# Altium project Power_backup_supercap.PrjPcb
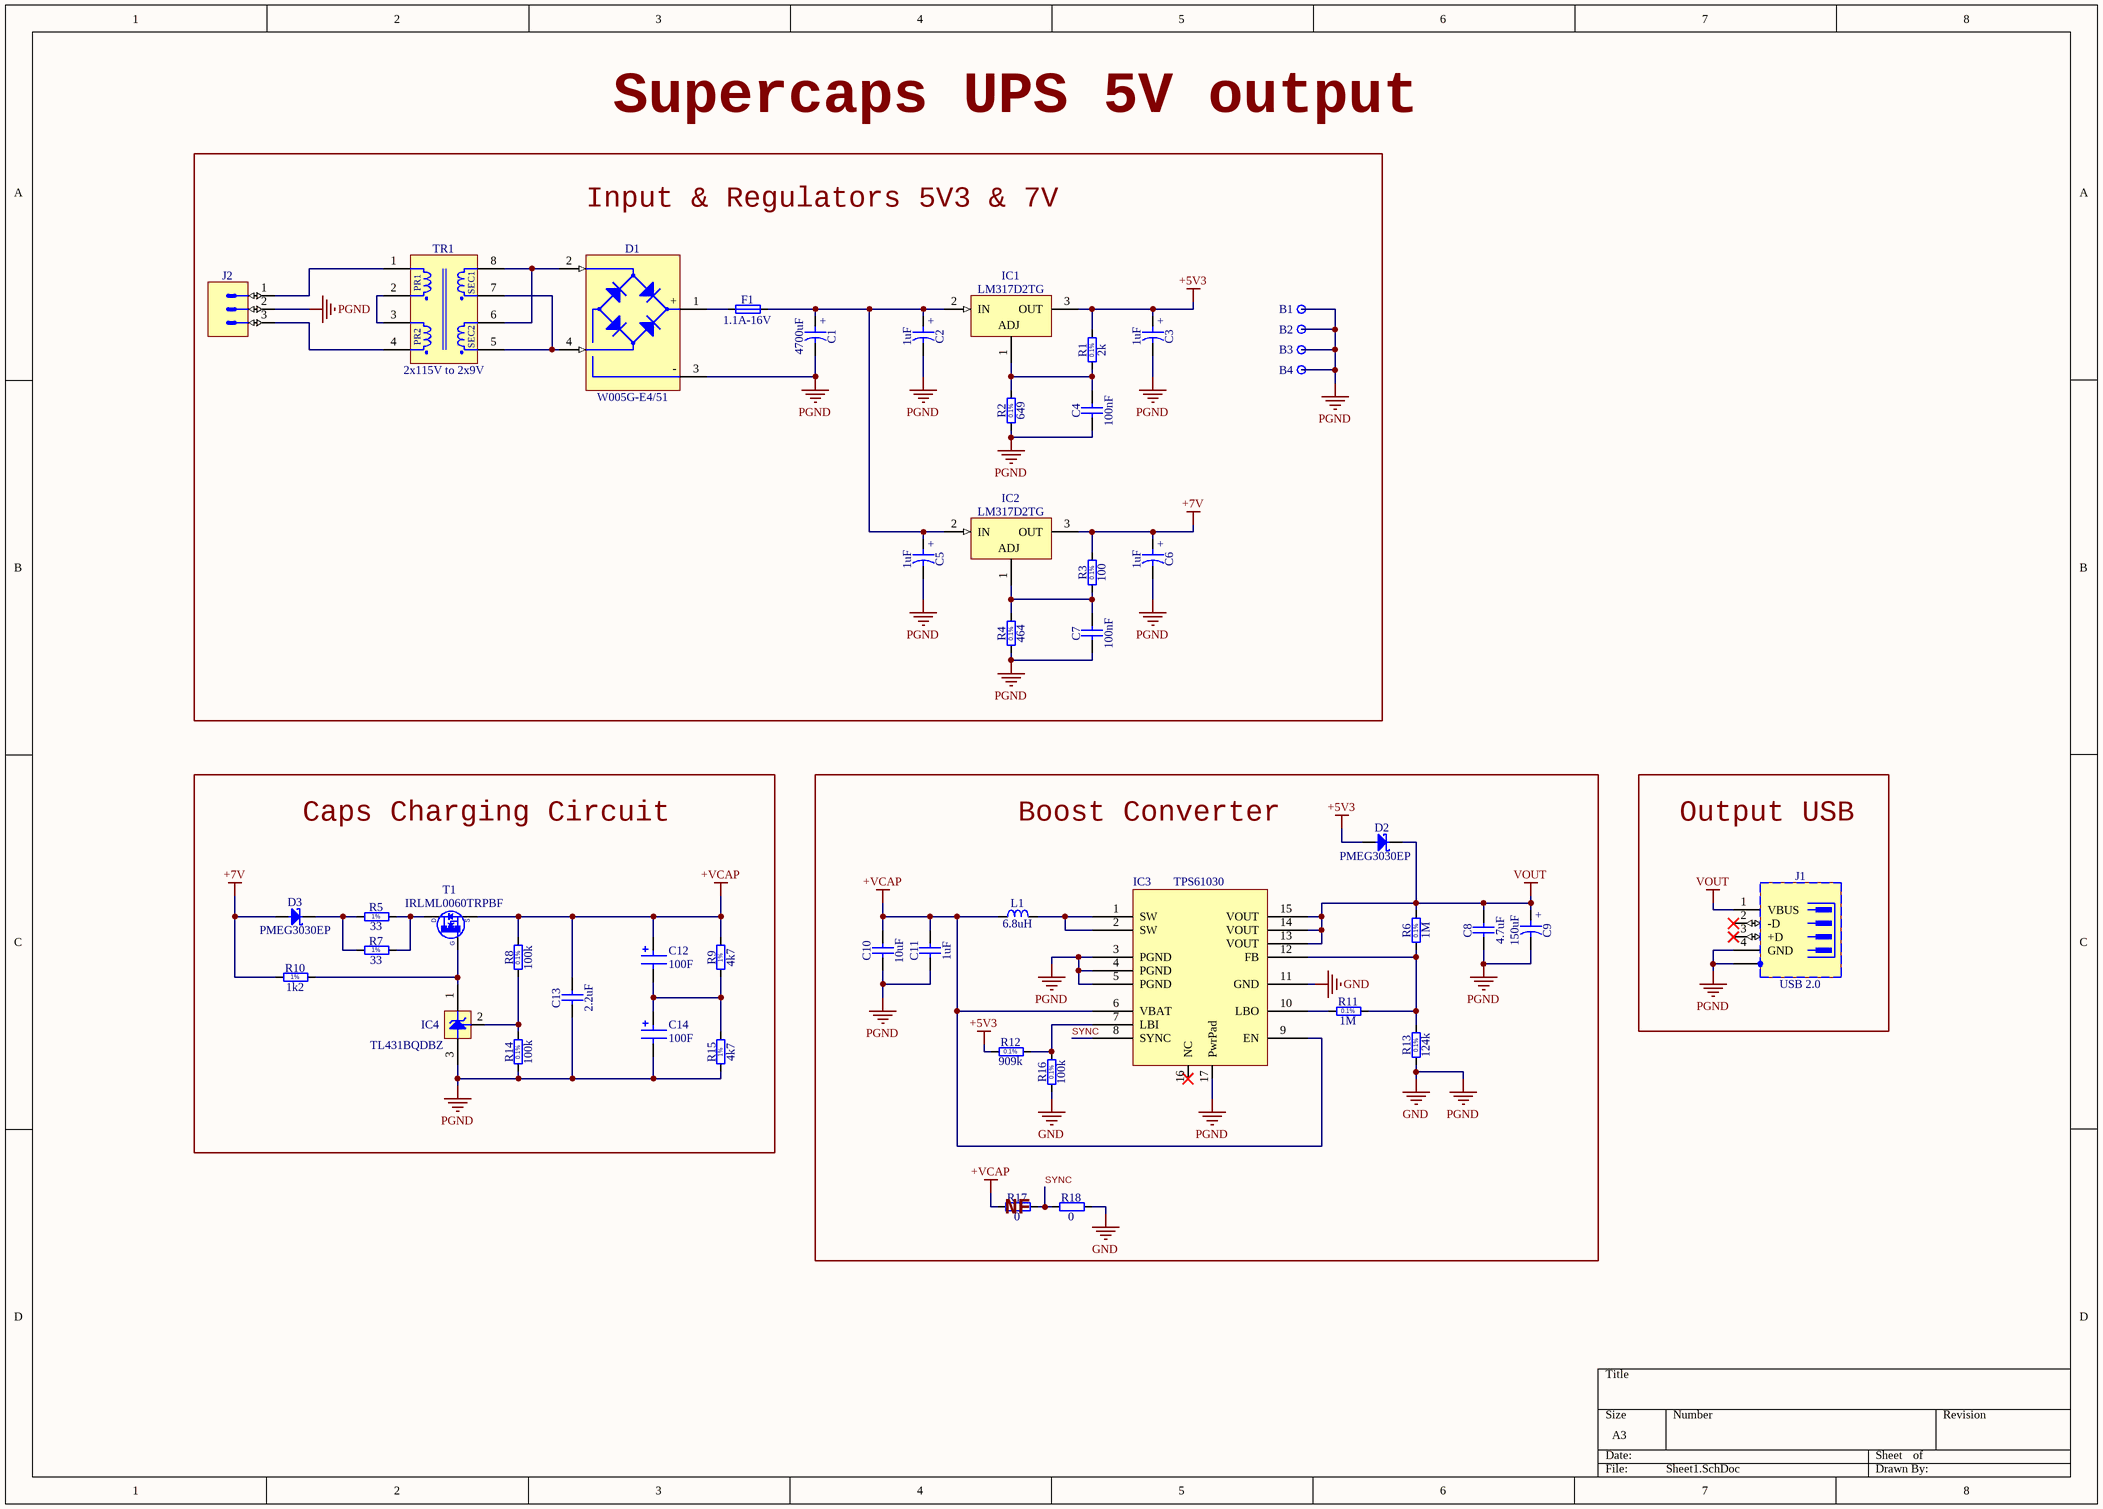
[diagram p0: Sheet1.SchDoc]
1 sheet, 49 parts. Net scope: global (net labels, ports and power ports of the same name join across sheets).
Board file: Backup_Supercap.PcbDoc

## Sheet Sheet1.SchDoc
size A3

### Parts
B1  Plated Hole  [MTG240_400]  (value not drawn)
B2  Plated Hole  [MTG240_400]  (value not drawn)
B3  Plated Hole  [MTG240_400]  (value not drawn)
B4  Plated Hole  [MTG240_400]  (value not drawn)
C1  4700uF  [CAPAE1900X1680N]
C2  1uF  [CAPMP3528X210N]
C3  1uF  [CAPMP3528X210N]
C4  100nF  [CAPC2012X88N]
C5  1uF  [CAPMP3528X210N]
C6  1uF  [CAPMP3528X210N]
C7  100nF  [CAPC2012X88N]
C8  4.7uF  [CAPC2012X135N]
C9  150uF  [CAPMP6032X280N]
C10  10uF  [CAPC2012X135N]
C11  1uF  [CAPC2012X135N]
C12  100F  [CAPPR750-1850X4650]
C13  2.2uF  [CAPC2012X140N]
C14  100F  [CAPPR750-1850X4650]
D1  W005G-E4/51  [VISHAY_WOG]
D2  PMEG3030EP  [SODFL4725X110N]
D3  PMEG3030EP  [SODFL4725X110N]
F1  1.1A-16V  [FUSR_BOURNS_MF-MSMF_STYLE1(H85)]
IC1  LM317D2TG  [TO254P1420X457-3N-R795X1023]
IC2  LM317D2TG  [TO254P1420X457-3N-R795X1023]
IC3  TPS61030  [SOP65P640X110-17N-S274]
IC4  TL431BQDBZ  [SOT95P250X110-3N]
J1  USB 2.0  [WURTH_614 104 150 121]
J2  MATE-N-LOK  [TYCO_1-770170-1]  (value not drawn)
L1  6.8uH  [IND_BOURNS_SRU8043]
R1  2k  [RESC2012X60N]
R2  649  [RESC2012X60N]
R3  100  [RESC2012X60N]
R4  464  [RESC2012X60N]
R5  33  [RESC6331X70N]
R6  1M  [RESC2012X60N]
R7  33  [RESC6331X70N]
R8  100k  [RESC2012X60N]
R9  4k7  [RESC2012X60N]
R10  1k2  [RESC2012X60N]
R11  1M  [RESC2012X60N]
R12  909k  [RESC2012X60N]
R13  124k  [RESC2012X60N]
R14  100k  [RESC2012X60N]
R15  4k7  [RESC2012X60N]
R16  100k  [RESC2012X60N]
R17  0  [RESC2012X60N]
R18  0  [RESC2012X60N]
T1  IRLML0060TRPBF  [SOT95P237X112-3N]
TR1  2x115V to 2x9V  [XFMR_BLOCK_FL6]

### Blocks framed on the sheet
Input & Regulators 5V3 & 7V: B1-B4 C1-C7 D1 F1 IC1 IC2 J2 R1-R4 TR1
Caps Charging Circuit: C12-C14 D3 IC4 R5 R7-R10 R14 R15 T1
Boost Converter: C8-C11 D2 IC3 L1 R6 R11-R13 R16-R18
Output USB: J1

### Nets
+5V3: C3.1 D2.2(A) IC1.3(OUT) R1.2 R12.1
+7V: C6.1 D3.2(A) IC2.3(OUT) R3.2 R10.1
+VCAP: C10.2 C11.2 C12.1 C13.2 IC3.6(VBAT) IC3.9(EN) L1.1 R8.2 R9.2 R17.1 T1.2(S)
GND: B1.1 B2.1 B3.1 B4.1 C1.2 C2.2 C3.2 C4.1 C5.2 C6.2 C7.1 C8.1 C9.2 C10.1 C11.1 C13.1 C14.2 D1.3(-) IC3.3(PGND) IC3.4(PGND) IC3.5(PGND) IC3.11(GND) IC3.17(PwrPad) IC4.3(A) J1.4(GND) J1.5(SHIELD) J2.2 R2.1 R4.1 R13.1 R14.1 R15.1 R16.1 R18.2  [also labelled PGND]
VOUT: C8.2 C9.1 D2.1(C) IC3.13(VOUT) IC3.14(VOUT) IC3.15(VOUT) J1.1(VBUS) R6.2
SYNC: IC3.8(SYNC) R17.2 R18.1
NetC1_1: C1.1 C2.1 C5.1 F1.2 IC1.2(IN) IC2.2(IN)
NetC4_2: C4.2 IC1.1(ADJ) R1.1 R2.2
NetC7_2: C7.2 IC2.1(ADJ) R3.1 R4.2
NetC12_2: C12.2 C14.1 R9.1 R15.2
NetD1_1: D1.1(+) F1.1
NetD1_2: D1.2(AC) TR1.6(S2) TR1.8(S1)
NetD1_4: D1.4(AC) TR1.5(S2) TR1.7(S1)
NetD3_1: D3.1(C) R5.1 R7.1
NetIC3_1: IC3.1(SW) IC3.2(SW) L1.2
NetIC3_7: IC3.7(LBI) R12.2 R16.2
NetIC3_10: IC3.10(LBO) R11.1
NetIC3_12: IC3.12(FB) R6.1 R11.2 R13.2
NetIC4_1: IC4.1(C) R10.2 T1.1(G)
NetIC4_2: IC4.2(Adj) R8.1 R14.2
NetJ2_1: J2.1 TR1.1(P1)
NetJ2_3: J2.3 TR1.4(P2)
NetR5_2: R5.2 R7.2 T1.3(D)
NetTR1_2: TR1.2(P1) TR1.3(P2)

Not connected (* = marked no-connect by the designer): IC3 16(NC)*; J1 2(-D)* 3(+D)*

### Notes on the sheet
- Supercaps UPS 5V output
- (near R17) NF
- (in symbol CAE1900-1680_4700UF_16V_20%) +
- (in symbol CTE3528-21_1UF_35V_10%_LESR2000) +
- (in symbol CTE6032-28_150UF_10V_10%) +
- (in symbol R0805_1K2_1%_0.125W_100PPM) 1%
- (in symbol R0805_1M_0.1%_0.1W_25PPM) 0.1%
- (in symbol R0805_2K_0.1%_0.1W_10PPM) 0.1%
- (in symbol R0805_4K7_1%_0.125W_100PPM) 1%
- (in symbol R0805_100K_0.1%_0.1W_10PPM) 0.1%
- (in symbol R0805_100R_0.1%_0.1W_10PPM) 0.1%
- (in symbol R0805_124K_0.1%_0.1W_10PPM) 0.1%
- (in symbol R0805_464R_0.1%_0.1W_10PPM) 0.1%
- (in symbol R0805_649R_0.1%_0.1W_10PPM) 0.1%
- (in symbol R0805_909K_0.1%_0.1W_10PPM) 0.1%
- (in symbol R2512_33R_1%_1W_100PPM) 1%
- (in symbol XFMR_BLOCK_FL6/6) PR1; SEC1; PR2; SEC2

### Library data of the parts
B1-B4 = PLATED_HOLE2.4_PAD4.0: Single Terminal Socket; Part Description: Plated Through Hole: Hole Dia.=2.4mm Pad Dia.=4.0mm; Mounted: No; Part Number: PLATED_HOLE2.4_PAD4.0; Component Kind: Standard (No BOM); Component Type: Standard (No BOM); Pin Count: 1; Family: Plated Hole; Socket: No; SMD: No; Sense: No; Status: None; ComponentHeight: 0mm; HelpURL: Undefined; Author: CERN DEM JMW; CreateDate: 10/10/2011; LatestRevisionDate: 10/10/2011; PackageDescription: Plated Through Hole: Hole Dia.=2.4mm Pad Dia.=4.0mm
C1 = CAE1900-1680_4700UF_16V_20%: Polarised capacitor; Part Description: Aluminum Electrolytic SMT Capacitor; Manufacturer: PANASONIC; Manufacturer Part Number: EEVFK1C472M; Voltage: 16V; Tolerance: ±20%; Part Number: CAE1900-1680_4700UF_16V_20%; Component Kind: Standard; Component Type: Standard; Pin Count: 2; Value: 4700uF; Status: Not Recommended; Case: K16; Mounted: Yes; Socket: No; SMD: Yes; Sense: No; ComponentHeight: 16.8mm; HelpURL: \\cern.ch\dfs\Applications\Altium\Datasheets\CAE_PANASONIC_FK.pdf; Author: CERN DEM JLC; CreateDate: 05/11/2014; LatestRevisionDate: 05/11/2014
C2 C3 C5 C6 = CTE3528-21_1UF_35V_10%_LESR2000: Polarised capacitor; Part Description: Low ESR 2R Solid Tantalum Chip Capacitor; Manufacturer: GENERIC; Manufacturer1 Part Number: TPSB105K035R2000; Voltage: 35V; Tolerance: ±10%; Part Number: CTE3528-21_1UF_35V_10%_LESR2000; Component Kind: Standard; Component Type: Standard; Pin Count: 2; Value: 1uF; Status: Preferred; Manufacturer Part Number: CTE3528-21_1UF_35V_10%_LESR2000; Case: B; Mounted: Yes; Socket: No; SMD: Yes; Sense: No; Manufacturer1 Example: AVX; Manufacturer1 ComponentHeight: 2.1mm; HelpURL: \\cern.ch\dfs\Applications\Altium\Datasheets\CTE-LESR_AVX_TPS.pdf; Author: CERN DEM MR; CreateDate: 04/10/2016; LatestRevisionDate: 04/10/2016
C4 C7 = CC0805_100NF_50V_10%_X7R_YUDEN_UMK212B7104KGHT: Non-polarised capacitor; Part Description: SMD Multilayer Chip Ceramic Capacitor (High Dielectric Type) for Automotive / Industrial Applications; Manufacturer: TAIYO YUDEN; Voltage: 50V; TC: X7R; Tolerance: ±10%; Part Number: CC0805_100NF_50V_10%_X7R_YUDEN_UMK212B7104KGHT; Component Kind: Standard; Component Type: Standard; Pin Count: 2; Value: 100nF; Status: Not Recommended; Manufacturer Part Number: UMK212B7104KGHT; Case: 0805; Mounted: Yes; Socket: No; SMD: Yes; Sense: No; ComponentHeight: 1.35mm; HelpURL: \\cern.ch\dfs\Applications\Altium\Datasheets\CC0805_TAIYO-YUDEN_UMK212B7104KGHT.pdf; Author: CERN DEM JLC; CreateDate: 23/04/2015; LatestRevisionDate: 23/04/2015
C8 = CC0805_4.7UF_10V_10%_X5R: Non-polarised capacitor; Part Description: SMD Multilayer Chip Ceramic Capacitor; Manufacturer: GENERIC; Manufacturer1 Part Number: 222224013672; Voltage: 10V; TC: X5R; Tolerance: ±10%; Part Number: CC0805_4.7UF_10V_10%_X5R; Component Kind: Standard; Component Type: Standard; Pin Count: 2; Value: 4.7uF; Status: Preferred; Manufacturer Part Number: CC0805_4.7UF_10V_10%_X5R; Case: 0805; Mounted: Yes; Socket: No; SMD: Yes; Sense: No; Manufacturer1 Example: PHYCOMP; Manufacturer1 ComponentHeight: 1.45mm; HelpURL: \\cern.ch\dfs\Applications\Altium\Datasheets\CC0805_X5R_PHYCOMP_HC.pdf; Author: CERN DEM JLC; CreateDate: 03/12/2007; LatestRevisionDate: 03/12/2007
C9 = CTE6032-28_150UF_10V_10%: Polarised capacitor; Part Description: Solid Tantalum Chip Capacitor; Manufacturer: GENERIC; Manufacturer1 Part Number: TAJC157K010R; Voltage: 10V; Tolerance: ±10%; Part Number: CTE6032-28_150UF_10V_10%; Component Kind: Standard; Component Type: Standard; Pin Count: 2; Value: 150uF; Status: Preferred; Manufacturer Part Number: CTE6032-28_150UF_10V_10%; Case: C; Mounted: Yes; Socket: No; SMD: Yes; Sense: No; Manufacturer1 Example: AVX; Manufacturer1 ComponentHeight: 2.8mm; HelpURL: \\cern.ch\dfs\Applications\Altium\Datasheets\CTE_AVX_TAJ.pdf; Author: CERN DEM JLC; CreateDate: 03/12/2007; LatestRevisionDate: 03/12/2007
C10 = CC0805_10UF_16V_10%_X5R: Non-polarised capacitor; Part Description: SMD Multilayer Chip Ceramic Capacitor; Manufacturer: GENERIC; Manufacturer1 Part Number: C0805C106K4PAC; Voltage: 16V; TC: X5R; Tolerance: ±10%; Part Number: CC0805_10UF_16V_10%_X5R; Component Kind: Standard; Component Type: Standard; Pin Count: 2; Value: 10uF; Status: Preferred; Manufacturer Part Number: CC0805_10UF_16V_10%_X5R; Case: 0805; Mounted: Yes; Socket: No; SMD: Yes; Sense: No; Manufacturer1 Example: KEMET; Manufacturer1 ComponentHeight: 1.4mm; HelpURL: \\cern.ch\dfs\Applications\Altium\Datasheets\CC1206_X5R_KEMET.pdf; Author: CERN DEM JLC; CreateDate: 03/12/2007; LatestRevisionDate: 03/12/2007
C11 = CC0805_1UF_16V_10%_X7R: Non-polarised capacitor; Part Description: SMD Multilayer Chip Ceramic Capacitor; Manufacturer: GENERIC; Manufacturer1 Part Number: C2012X7R1C105K125AA; Voltage: 16V; TC: X7R; Tolerance: ±10%; Part Number: CC0805_1UF_16V_10%_X7R; Component Kind: Standard; Component Type: Standard; Pin Count: 2; Value: 1uF; Status: Preferred; Manufacturer Part Number: CC0805_1UF_16V_10%_X7R; Case: 0805; Mounted: Yes; Socket: No; SMD: Yes; Sense: No; Manufacturer1 Example: TDK; Manufacturer1 ComponentHeight: 1.45mm; HelpURL: \\cern.ch\dfs\Applications\Altium\Datasheets\CC0805_X7R_TDK_C.pdf; Author: CERN DEM JLC; CreateDate: 03/12/2007; LatestRevisionDate: 22/04/2015
C12 C14 = 100F SuperCapacitor: EECHL0E107
C13 = CC0805_2.2UF_16V_10%_X7R_KEMET_C0805C225K4RACAUTO: Non-polarised capacitor; Part Description: SMD Multilayer Chip Ceramic Capacitor (Automotive Grade); Manufacturer: KEMET; Voltage: 16V; TC: X7R; Tolerance: ±10%; Part Number: CC0805_2.2UF_16V_10%_X7R_KEMET_C0805C225K4RACAUTO; Component Kind: Standard; Component Type: Standard; Pin Count: 2; Value: 2.2uF; Status: Not Recommended; Manufacturer Part Number: C0805C225K4RACAUTO; Case: 0805; Mounted: Yes; Socket: No; SMD: Yes; Sense: No; ComponentHeight: 1.4mm; HelpURL: \\cern.ch\dfs\Applications\Altium\Datasheets\CC0805_KEMET_C0805C225K4RACAUTO.pdf; Author: CERN DEM MR; CreateDate: 01/10/2018; LatestRevisionDate: 01/10/2018
D1 = W005G-E4/51: Bridge Rectifier 1+ 2AC 3- 4AC; Part Description: Glass Passivated Single-Phase Bridge Rectifier; Manufacturer: VISHAY GENERAL SEMICONDUCTOR; Voltage: 50V; Power: 1.5A; PressFit: No; Bonding: No; Part Number: W005G-E4/51; Component Kind: Standard; Component Type: Standard; Device: W005G-E4/51; PackageDescription: Bridge Rectifier, Body 9.35m x 8.33mm, VISHAY Case Type WOG; Manufacturer Part Number: W005G-E4/51; Pin Count: 4; Mounted: Yes; Socket: No; SMD: No; Sense: No; ComponentHeight: 13.5mm; HelpURL: \\cern.ch\dfs\Applications\Altium\Datasheets\W005G-E4-51.pdf; Author: CERN DEM JLC; CreateDate: 20/09/2011; LatestRevisionDate: 08/04/2016
D2 D3 = PMEG3030EP: Schottky Diode; Part Description: Low VF MEGA Schottky Barrier Rectifier; Manufacturer: NEXPERIA; Voltage: 30V; Power: 3A; PressFit: No; Bonding: No; Part Number: PMEG3030EP; Component Kind: Standard; Component Type: Standard; Device: PMEG3030EP; PackageDescription: SOD128, SODFL Diode; 3.80mm W X 2.50mm L X 1.10mm H Body, IPC Medium Density; Manufacturer Part Number: PMEG3030EP; Pin Count: 2; Case: SOD128; Mounted: Yes; Socket: No; SMD: Yes; Sense: No; ComponentHeight: 1.1mm; HelpURL: \\cern.ch\dfs\Applications\Altium\Datasheets\PMEG3030EP.pdf; Author: CERN DEM JLC; CreateDate: 17/09/2018; LatestRevisionDate: 17/09/2018
F1 = FUSR_BOURNS_MF-MSMF110/16-2: Fuse; Part Description: PTC Resettable Fuse; Manufacturer: BOURNS; PressFit: No; Part Number: FUSR_BOURNS_MF-MSMF110/16-2; Component Kind: Standard; Component Type: Standard; Pin Count: 2; PackageDescription: PTC Resettable Fuse, MF-MSMS Series, Case Style 1 Height 0.85mm; Family: Fuses Resettable; Mounted: Yes; Socket: No; SMD: Yes; Sense: No; Value: 1.1A-16V; Manufacturer Part Number: MF-MSMF110/16-2; ComponentHeight: 0.85mm; HelpURL: \\cern.ch\dfs\Applications\Altium\Datasheets\FUSR_BOURNS_MF-MSMF.pdf; Author: CERN DEM JLC; CreateDate: 02/03/2011; LatestRevisionDate: 29/11/2012
IC1 IC2 = LM317D2TG: 3-Terminal Regulator 1=Adj 2=IN 3=OUT; Part Description: 1.2V To 37V, 1.5A Adjustable Positive Voltage Regulator; Manufacturer: ON SEMICONDUCTOR; PressFit: No; Bonding: No; Part Number: LM317D2TG; Component Kind: Standard; Component Type: Standard; Device: LM317D2TG; PackageDescription: D2PAK TO-263, TO, 2.54mm pitch; 3 pin, 14.199mm L X 9.195mm W X 4.57mm H body, IPC Medium Density; Manufacturer Part Number: LM317D2TG; Pin Count: 3; Case: D2PAK; Mounted: Yes; Socket: No; SMD: Yes; Sense: No; ComponentHeight: 4.57mm; HelpURL: \\cern.ch\dfs\Applications\Altium\Datasheets\LM317D2TG.pdf; Author: CERN DEM JLC; CreateDate: 19/05/2010; LatestRevisionDate: 19/05/2010
IC3 = TPS61030: Boost converter
IC4 = TL431BQDBZ: Precision Reference 1=Cathode 2=Adj 3=Anode; Part Description: Vref (2.495V) To 36V 0.5% Precision Programmable Reference; Manufacturer: NXP SEMICONDUCTORS; PressFit: No; Bonding: No; Part Number: TL431BQDBZ; Component Kind: Standard; Component Type: Standard; Device: TL431BQDBZ; PackageDescription: SOT23, 0.95mm Pitch; 3 Pin, 1.3mm W X 2.9mm L X 1.1mm H Body, IPC Medium Density; Manufacturer Part Number: TL431BQDBZ; Pin Count: 3; Case: SOT23; Mounted: Yes; Socket: No; SMD: Yes; Sense: No; ComponentHeight: 1.1mm; HelpURL: \\cern.ch\dfs\Applications\Altium\Datasheets\TL431BQDBZ.pdf; Author: CERN DEM MR; CreateDate: 18/04/2016; LatestRevisionDate: 18/04/2016
J1 = WURTH_614 104 150 121: 4 Pin + 1 Shield USB Receptacle; Part Description: USB 2.0 Type A Receptacle, Right Angle, SLIM Type, 4 Contacts; Manufacturer: WURTH ELEKTRONIK; PressFit: No; Part Number: WURTH_614 104 150 121; Component Kind: Standard; Component Type: Standard; Pin Count: 5; Family: USB 2.0; Mounted: Yes; Socket: No; SMD: No; Sense: No; Status: None; Manufacturer Part Number: 614 104 150 121; ComponentHeight: 7.2mm; HelpURL: \\cern.ch\dfs\Applications\Altium\Datasheets\WURTH_614 104 150 121.pdf; Author: CERN DEM JMW; CreateDate: 07/07/2015; LatestRevisionDate: 07/07/2015
J2 = TYCO_1-770170-1: Connector 3 Male; Part Description: 3 Circuits In-Line, Mini-Universal MATE-N-LOK Connector; Manufacturer: TYCO ELECTRONICS; PressFit: No; Part Number: TYCO_1-770170-1; Component Kind: Standard; Component Type: Standard; Pin Count: 3; Family: MATE-N-LOK; Mounted: Yes; Socket: No; SMD: No; Sense: No; Status: None; Manufacturer Part Number: 1-770170-1; ComponentHeight: 14.25mm; HelpURL: \\cern.ch\dfs\Applications\Altium\Datasheets\TYCO_1-770170-1.pdf; Author: CERN DEM JLC; CreateDate: 26/05/2011; LatestRevisionDate: 26/05/2011
L1 = IND_6.8UH_30%_BOURNS_SRU8043: Inductor; Part Description: Shielded SMD Power Inductor; Manufacturer: BOURNS; Manufacturer Part Number: SRU8043-6R8Y; Power: 3.8A; Resistance: 0.0224R; Tolerance: ±30%; Part Number: IND_6.8UH_30%_BOURNS_SRU8043; Component Kind: Standard; Component Type: Standard; Pin Count: 2; Value: 6.8uH; Status: None; Mounted: Yes; Socket: No; SMD: Yes; Sense: No; ComponentHeight: 4.6mm; HelpURL: \\cern.ch\dfs\Applications\Altium\Datasheets\IND_BOURNS_SRU8043.pdf; Author: CERN DEM JMW; CreateDate: 06/08/2015; LatestRevisionDate: 06/08/2015
R1 = R0805_2K_0.1%_0.1W_10PPM: Resistor - 0.1%; Part Description: Thin Film Chip Resistor; Manufacturer: GENERIC; Manufacturer1 Part Number: RN73C2A2K0BTG; Power: 0.1W; TC: ±10ppm; PressFit: No; Part Number: R0805_2K_0.1%_0.1W_10PPM; Component Kind: Standard; Component Type: Standard; Pin Count: 2; Value: 2k; Status: Not Recommended; Tolerance: ±0.1%; Manufacturer Part Number: R0805_2K_0.1%_0.1W_10PPM; Case: 0805; Mounted: Yes; Sense: No; Socket: No; SMD: Yes; Manufacturer1 Example: TYCO HOLSWORTHY; Manufacturer1 ComponentHeight: 0.6mm; HelpURL: \\cern.ch\dfs\Applications\Altium\Datasheets\R0805_Tyco_RN73.pdf; Author: CERN DEM JLC; CreateDate: 03/12/2007; LatestRevisionDate: 13/03/2008
R2 = R0805_649R_0.1%_0.1W_10PPM: Resistor - 0.1%; Part Description: Thin Film Chip Resistor; Manufacturer: GENERIC; Manufacturer1 Part Number: RN73C2A649RBTG; Power: 0.1W; TC: ±10ppm; PressFit: No; Part Number: R0805_649R_0.1%_0.1W_10PPM; Component Kind: Standard; Component Type: Standard; Pin Count: 2; Value: 649; Status: Not Recommended; Tolerance: ±0.1%; Manufacturer Part Number: R0805_649R_0.1%_0.1W_10PPM; Case: 0805; Mounted: Yes; Sense: No; Socket: No; SMD: Yes; Manufacturer1 Example: TYCO HOLSWORTHY; Manufacturer1 ComponentHeight: 0.6mm; HelpURL: \\cern.ch\dfs\Applications\Altium\Datasheets\R0805_Tyco_RN73.pdf; Author: CERN DEM JLC; CreateDate: 03/12/2007; LatestRevisionDate: 13/03/2008
R3 = R0805_100R_0.1%_0.1W_10PPM: Resistor - 0.1%; Part Description: Thin Film Chip Resistor; Manufacturer: GENERIC; Manufacturer1 Part Number: RN73C2A100RBTG; Power: 0.1W; TC: ±10ppm; PressFit: No; Part Number: R0805_100R_0.1%_0.1W_10PPM; Component Kind: Standard; Component Type: Standard; Pin Count: 2; Value: 100; Status: Not Recommended; Tolerance: ±0.1%; Manufacturer Part Number: R0805_100R_0.1%_0.1W_10PPM; Case: 0805; Mounted: Yes; Sense: No; Socket: No; SMD: Yes; Manufacturer1 Example: TYCO HOLSWORTHY; Manufacturer1 ComponentHeight: 0.6mm; HelpURL: \\cern.ch\dfs\Applications\Altium\Datasheets\R0805_Tyco_RN73.pdf; Author: CERN DEM JLC; CreateDate: 03/12/2007; LatestRevisionDate: 13/03/2008
R4 = R0805_464R_0.1%_0.1W_10PPM: Resistor - 0.1%; Part Description: Thin Film Chip Resistor; Manufacturer: GENERIC; Manufacturer1 Part Number: RN73C2A464RBTG; Power: 0.1W; TC: ±10ppm; PressFit: No; Part Number: R0805_464R_0.1%_0.1W_10PPM; Component Kind: Standard; Component Type: Standard; Pin Count: 2; Value: 464; Status: Not Recommended; Tolerance: ±0.1%; Manufacturer Part Number: R0805_464R_0.1%_0.1W_10PPM; Case: 0805; Mounted: Yes; Sense: No; Socket: No; SMD: Yes; Manufacturer1 Example: TYCO HOLSWORTHY; Manufacturer1 ComponentHeight: 0.6mm; HelpURL: \\cern.ch\dfs\Applications\Altium\Datasheets\R0805_Tyco_RN73.pdf; Author: CERN DEM JLC; CreateDate: 03/12/2007; LatestRevisionDate: 13/03/2008
R5 R7 = R2512_33R_1%_1W_100PPM: Resistor - 1%; Part Description: Thick Film Chip Resistor; Manufacturer: GENERIC; Manufacturer1 Part Number: 232276363309L or RC2512FK-0733RL; Power: 1W; TC: ±100ppm/°C; PressFit: No; Part Number: R2512_33R_1%_1W_100PPM; Component Kind: Standard; Component Type: Standard; Pin Count: 2; Value: 33; Status: Preferred; Tolerance: ±1%; Manufacturer Part Number: R2512_33R_1%_1W_100PPM; Case: 2512; Mounted: Yes; Sense: No; Socket: No; SMD: Yes; Manufacturer1 Example: YAGEO PHYCOMP; Manufacturer1 ComponentHeight: 0.65mm; HelpURL: \\cern.ch\dfs\Applications\Altium\Datasheets\R2512_Phycomp_RC2512.pdf; Author: CERN DEM JLC; CreateDate: 21/07/2008; LatestRevisionDate: 17/10/2012
R6 R11 = R0805_1M_0.1%_0.1W_25PPM: Resistor - 0.1%; Part Description: Precision Surface Mount Resistor; Manufacturer: GENERIC; Manufacturer1 Part Number: PCF0805R-1M0BT1; Power: 0.1W; TC: ±25ppm/°C; PressFit: No; Part Number: R0805_1M_0.1%_0.1W_25PPM; Component Kind: Standard; Component Type: Standard; Pin Count: 2; Value: 1M; Status: Not Recommended; Tolerance: ±0.1%; Manufacturer Part Number: R0805_1M_0.1%_0.1W_25PPM; Case: 0805; Mounted: Yes; Sense: No; Socket: No; SMD: Yes; Manufacturer1 Example: TT ELECTRONICS; Manufacturer1 ComponentHeight: 0.65mm; HelpURL: \\cern.ch\dfs\Applications\Altium\Datasheets\R0805_TT ELECTRONICS_PCF.pdf; Author: CERN DEM JLC; CreateDate: 17/11/2008; LatestRevisionDate: 25/10/2018
R8 R14 R16 = R0805_100K_0.1%_0.1W_10PPM: Resistor - 0.1%; Part Description: Thin Film Chip Resistor; Manufacturer: GENERIC; Manufacturer1 Part Number: RN73C2A100KBTG; Power: 0.1W; TC: ±10ppm; PressFit: No; Part Number: R0805_100K_0.1%_0.1W_10PPM; Component Kind: Standard; Component Type: Standard; Pin Count: 2; Value: 100k; Status: Not Recommended; Tolerance: ±0.1%; Manufacturer Part Number: R0805_100K_0.1%_0.1W_10PPM; Case: 0805; Mounted: Yes; Sense: No; Socket: No; SMD: Yes; Manufacturer1 Example: TYCO HOLSWORTHY; Manufacturer1 ComponentHeight: 0.6mm; HelpURL: \\cern.ch\dfs\Applications\Altium\Datasheets\R0805_Tyco_RN73.pdf; Author: CERN DEM JLC; CreateDate: 03/12/2007; LatestRevisionDate: 13/03/2008
R9 R15 = R0805_4K7_1%_0.125W_100PPM: Resistor - 1%; Part Description: General Purpose Thick Film Chip Resistor; Manufacturer: GENERIC; Manufacturer1 Part Number: NRC10F4701TRF; Power: 0.125W; TC: ±100ppm/°C; PressFit: No; Part Number: R0805_4K7_1%_0.125W_100PPM; Component Kind: Standard; Component Type: Standard; Pin Count: 2; Value: 4k7; Status: Preferred; Tolerance: ±1%; Manufacturer Part Number: R0805_4K7_1%_0.125W_100PPM; Case: 0805; Mounted: Yes; Sense: No; Socket: No; SMD: Yes; Manufacturer1 Example: NIC COMPONENT; Manufacturer1 ComponentHeight: 0.6mm; HelpURL: \\cern.ch\dfs\Applications\Altium\Datasheets\R0805_NIC_NRC.pdf; Author: CERN DEM JLC; CreateDate: 03/12/2007; LatestRevisionDate: 13/03/2008
R10 = R0805_1K2_1%_0.125W_100PPM: Resistor - 1%; Part Description: General Purpose Thick Film Chip Resistor; Manufacturer: GENERIC; Manufacturer1 Part Number: NRC10F1201TRF; Power: 0.125W; TC: ±100ppm/°C; PressFit: No; Part Number: R0805_1K2_1%_0.125W_100PPM; Component Kind: Standard; Component Type: Standard; Pin Count: 2; Value: 1k2; Status: Preferred; Tolerance: ±1%; Manufacturer Part Number: R0805_1K2_1%_0.125W_100PPM; Case: 0805; Mounted: Yes; Sense: No; Socket: No; SMD: Yes; Manufacturer1 Example: NIC COMPONENT; Manufacturer1 ComponentHeight: 0.6mm; HelpURL: \\cern.ch\dfs\Applications\Altium\Datasheets\R0805_NIC_NRC.pdf; Author: CERN DEM JLC; CreateDate: 03/12/2007; LatestRevisionDate: 13/03/2008
R12 = R0805_909K_0.1%_0.1W_10PPM: Resistor - 0.1%; Part Description: Thin Film Chip Resistor; Manufacturer: GENERIC; Manufacturer1 Part Number: RN73C2A909KBTG; Power: 0.1W; TC: ±10ppm; PressFit: No; Part Number: R0805_909K_0.1%_0.1W_10PPM; Component Kind: Standard; Component Type: Standard; Pin Count: 2; Value: 909k; Status: Not Recommended; Tolerance: ±0.1%; Manufacturer Part Number: R0805_909K_0.1%_0.1W_10PPM; Case: 0805; Mounted: Yes; Sense: No; Socket: No; SMD: Yes; Manufacturer1 Example: TYCO HOLSWORTHY; Manufacturer1 ComponentHeight: 0.6mm; HelpURL: \\cern.ch\dfs\Applications\Altium\Datasheets\R0805_Tyco_RN73.pdf; Author: CERN DEM MR; CreateDate: 12/10/2017; LatestRevisionDate: 12/10/2017
R13 = R0805_124K_0.1%_0.1W_10PPM: Resistor - 0.1%; Part Description: Thin Film Chip Resistor; Manufacturer: GENERIC; Manufacturer1 Part Number: RN73C2A124KBTG; Power: 0.1W; TC: ±10ppm; PressFit: No; Part Number: R0805_124K_0.1%_0.1W_10PPM; Component Kind: Standard; Component Type: Standard; Pin Count: 2; Value: 124k; Status: Not Recommended; Tolerance: ±0.1%; Manufacturer Part Number: R0805_124K_0.1%_0.1W_10PPM; Case: 0805; Mounted: Yes; Sense: No; Socket: No; SMD: Yes; Manufacturer1 Example: TYCO HOLSWORTHY; Manufacturer1 ComponentHeight: 0.6mm; HelpURL: \\cern.ch\dfs\Applications\Altium\Datasheets\R0805_Tyco_RN73.pdf; Author: CERN DEM JLC; CreateDate: 03/12/2007; LatestRevisionDate: 13/03/2008
R17 R18 = R0805_0R_JUMPER: Resistor; Part Description: 2A (0.05R Max DC Resistance) Zero Ohm Jumper; Manufacturer: GENERIC; Manufacturer1 Part Number: NRC10Z0; PressFit: No; Part Number: R0805_0R_JUMPER; Component Kind: Standard; Component Type: Standard; Pin Count: 2; Value: 0; Status: Preferred; Manufacturer Part Number: R0805_0R_JUMPER; Case: 0805; Mounted: Yes; Sense: No; Socket: No; SMD: Yes; Manufacturer1 Example: NIC COMPONENT; Manufacturer1 ComponentHeight: 0.6mm; HelpURL: \\cern.ch\dfs\Applications\Altium\Datasheets\R0805_NIC_NRC.pdf; Author: CERN DEM JLC; CreateDate: 03/12/2007; LatestRevisionDate: 13/03/2008
T1 = IRLML0060TRPBF: N-CHANNEL MOSFET WITH DIODE; Part Description: 60V 2.7A N-Channel HEXFET® Power MOSFET; Manufacturer: INTERNATIONAL RECTIFIER; PressFit: No; Bonding: No; Part Number: IRLML0060TRPBF; Component Kind: Standard; Component Type: Standard; Device: IRLML0060TRPBF; PackageDescription: SOT, 0.95mm, pitch; 3 pin,1.30mm W X 2.92mm L X 1.12mm H body, IPC Medium Density; Manufacturer Part Number: IRLML0060TRPBF; Pin Count: 3; Case: SOT23-3; Mounted: Yes; Socket: No; SMD: Yes; Sense: No; ComponentHeight: 1.12mm; HelpURL: \\cern.ch\dfs\Applications\Altium\Datasheets\IRLML0060TRPBF.pdf; Author: CERN DEM JLC; CreateDate: 06/10/2011; LatestRevisionDate: 06/10/2011
TR1 = XFMR_BLOCK_FL6/6: Transformer 2xPrim 2xSec Type1; Part Description: 6VA Low Profile Transformer Type FL; Manufacturer: BLOCK TRANSFORMATOREN ELEKTRONIK; Manufacturer Part Number: FL6/6; Part Number: XFMR_BLOCK_FL6/6; Component Kind: Standard; Component Type: Standard; Pin Count: 8; Value: 2x115V to 2x9V; Status: None; Mounted: Yes; Socket: No; Sense: No; SMD: No; ComponentHeight: 22.6mm; HelpURL: \\cern.ch\dfs\Applications\Altium\Datasheets\XFMR_BLOCK_FL6-6.pdf; Author: CERN DEM JLC; CreateDate: 04/06/2015; LatestRevisionDate: 04/06/2015